# Altium schematic sheet Relay.SchDoc
size A4
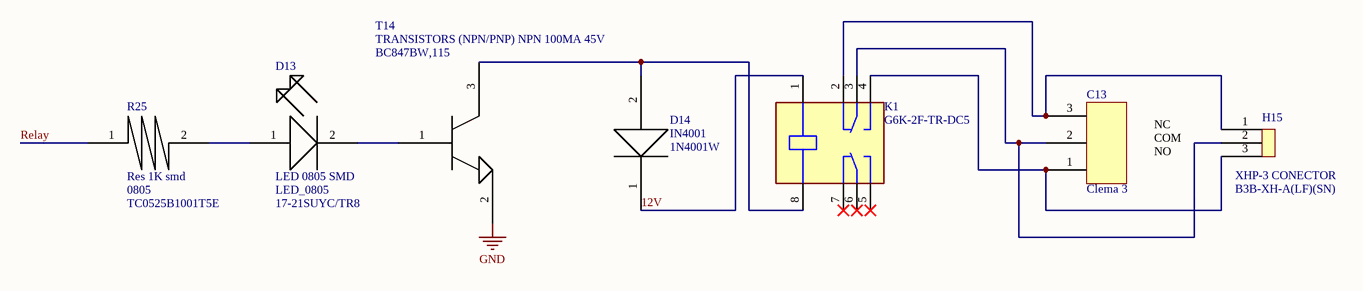
[diagram p0: Relay.SchDoc]

## Parts
C13  Clema 3  [Clema3]
D13  LED 0805 SMD  Package: LED_0805  MFR.Part #: 17-21SUYC/TR8  [LED SMD Amarillo]
D14  IN4001  Supplier Number Part: 1N4001W  [C162732]
H15  XHP-3 CONECTOR  [CONECTOR XHP-3]
K1  G6K-2F-TR-DC5  [RELAY_G6K-2F-TR-DC5]
R25  Res 1K smd  Package: 0805  MFR.Part #: TC0525B1001T5E  [RES 1K]
T14  TRANSISTORS (NPN/PNP) NPN 100MA 45V  Supplier Number Part: BC847BW,115  [C8659]

## Nets
GND: T14.2
12V: D14.1 K1.1
Relay: R25.1
NetC13_1: C13.1 H15.3 K1.4
NetC13_2: C13.2 H15.2 K1.3
NetC13_3: C13.3 H15.1 K1.2
NetD13_1: D13.1 R25.2
NetD13_2: D13.2 T14.1
NetD14_2: D14.2 K1.8 T14.3

Not connected (* = marked no-connect by the designer): K1 5* 6* 7*

## Notes on the sheet
- NC
  COM
  NO

## Library data of the parts
C13 = Clema3
D13 = LED 0805 SMD: LED 0805 Yellow
D14 = C162732: DIODES - GENERAL PURPOSE 50V 1A 1.1V @ 1A SOD-123F ROHS; Package Part: SOD-123
H15 = B3B-XH-A(LF)(SN): CONECTOR JST-XH 3 PINES; SUPPLIER NUMBER PART: B3B-XH-A(LF)(SN)
K1 = G6K-2F-TR-DC5: Telecom Relay DPDT (2 Form C) Surface Mount; MF: Omron Electronics; Availability: Warning; Check_prices: https://www.snapeda.com/parts/G6K-2F-TR-DC5/Omron%20Electronics%20Inc-EMC%20Div/view-part/2886130/?ref=eda; Value: *; Package: None; MP: G6K-2F-TR-DC5; Price: None; Purchase-URL: https://pricing.snapeda.com/search/part/G6K-2F-TR-DC5/?ref=eda; SnapEDA_Link: https://www.snapeda.com/parts/G6K-2F-TR-DC5/Omron%20Electronics%20Inc-EMC%20Div/view-part/2886130/?ref=snap
T14 = C8659: TRANSISTORS (NPN/PNP) NPN 100MA 45V SOT-323(SC-70) ROHS; Package Part: SOT-323-3